# Altium schematic sheet AWG_ClockRecovery.SchDoc: Clock recovery
size 420 x 297 mm; EDA_Number: ARTIQ; Projet: ARTIQ/SINARA; CheckedBy: G.Kasprowicz; Author: F.Switakowski; CompanyName: WUT ISE; DrawnBy: F.Switakowski; Organization: WUT ISE; Address1: PW ISE; Address2: Nowowiejska 15/19 00-665 Warsaw; Address3: gkasprow@gmail.com; DocumentNumber: 4; Revision: 1; SheetNumber: 4; SheetTotal: 20; ModifiedBy: -; CheckedDate: -; Title2: & distribution; DivGrp: WUT ISE; Designer: G.Kasprowicz; ModifiedDate: -; ProjectName: Sensor Box
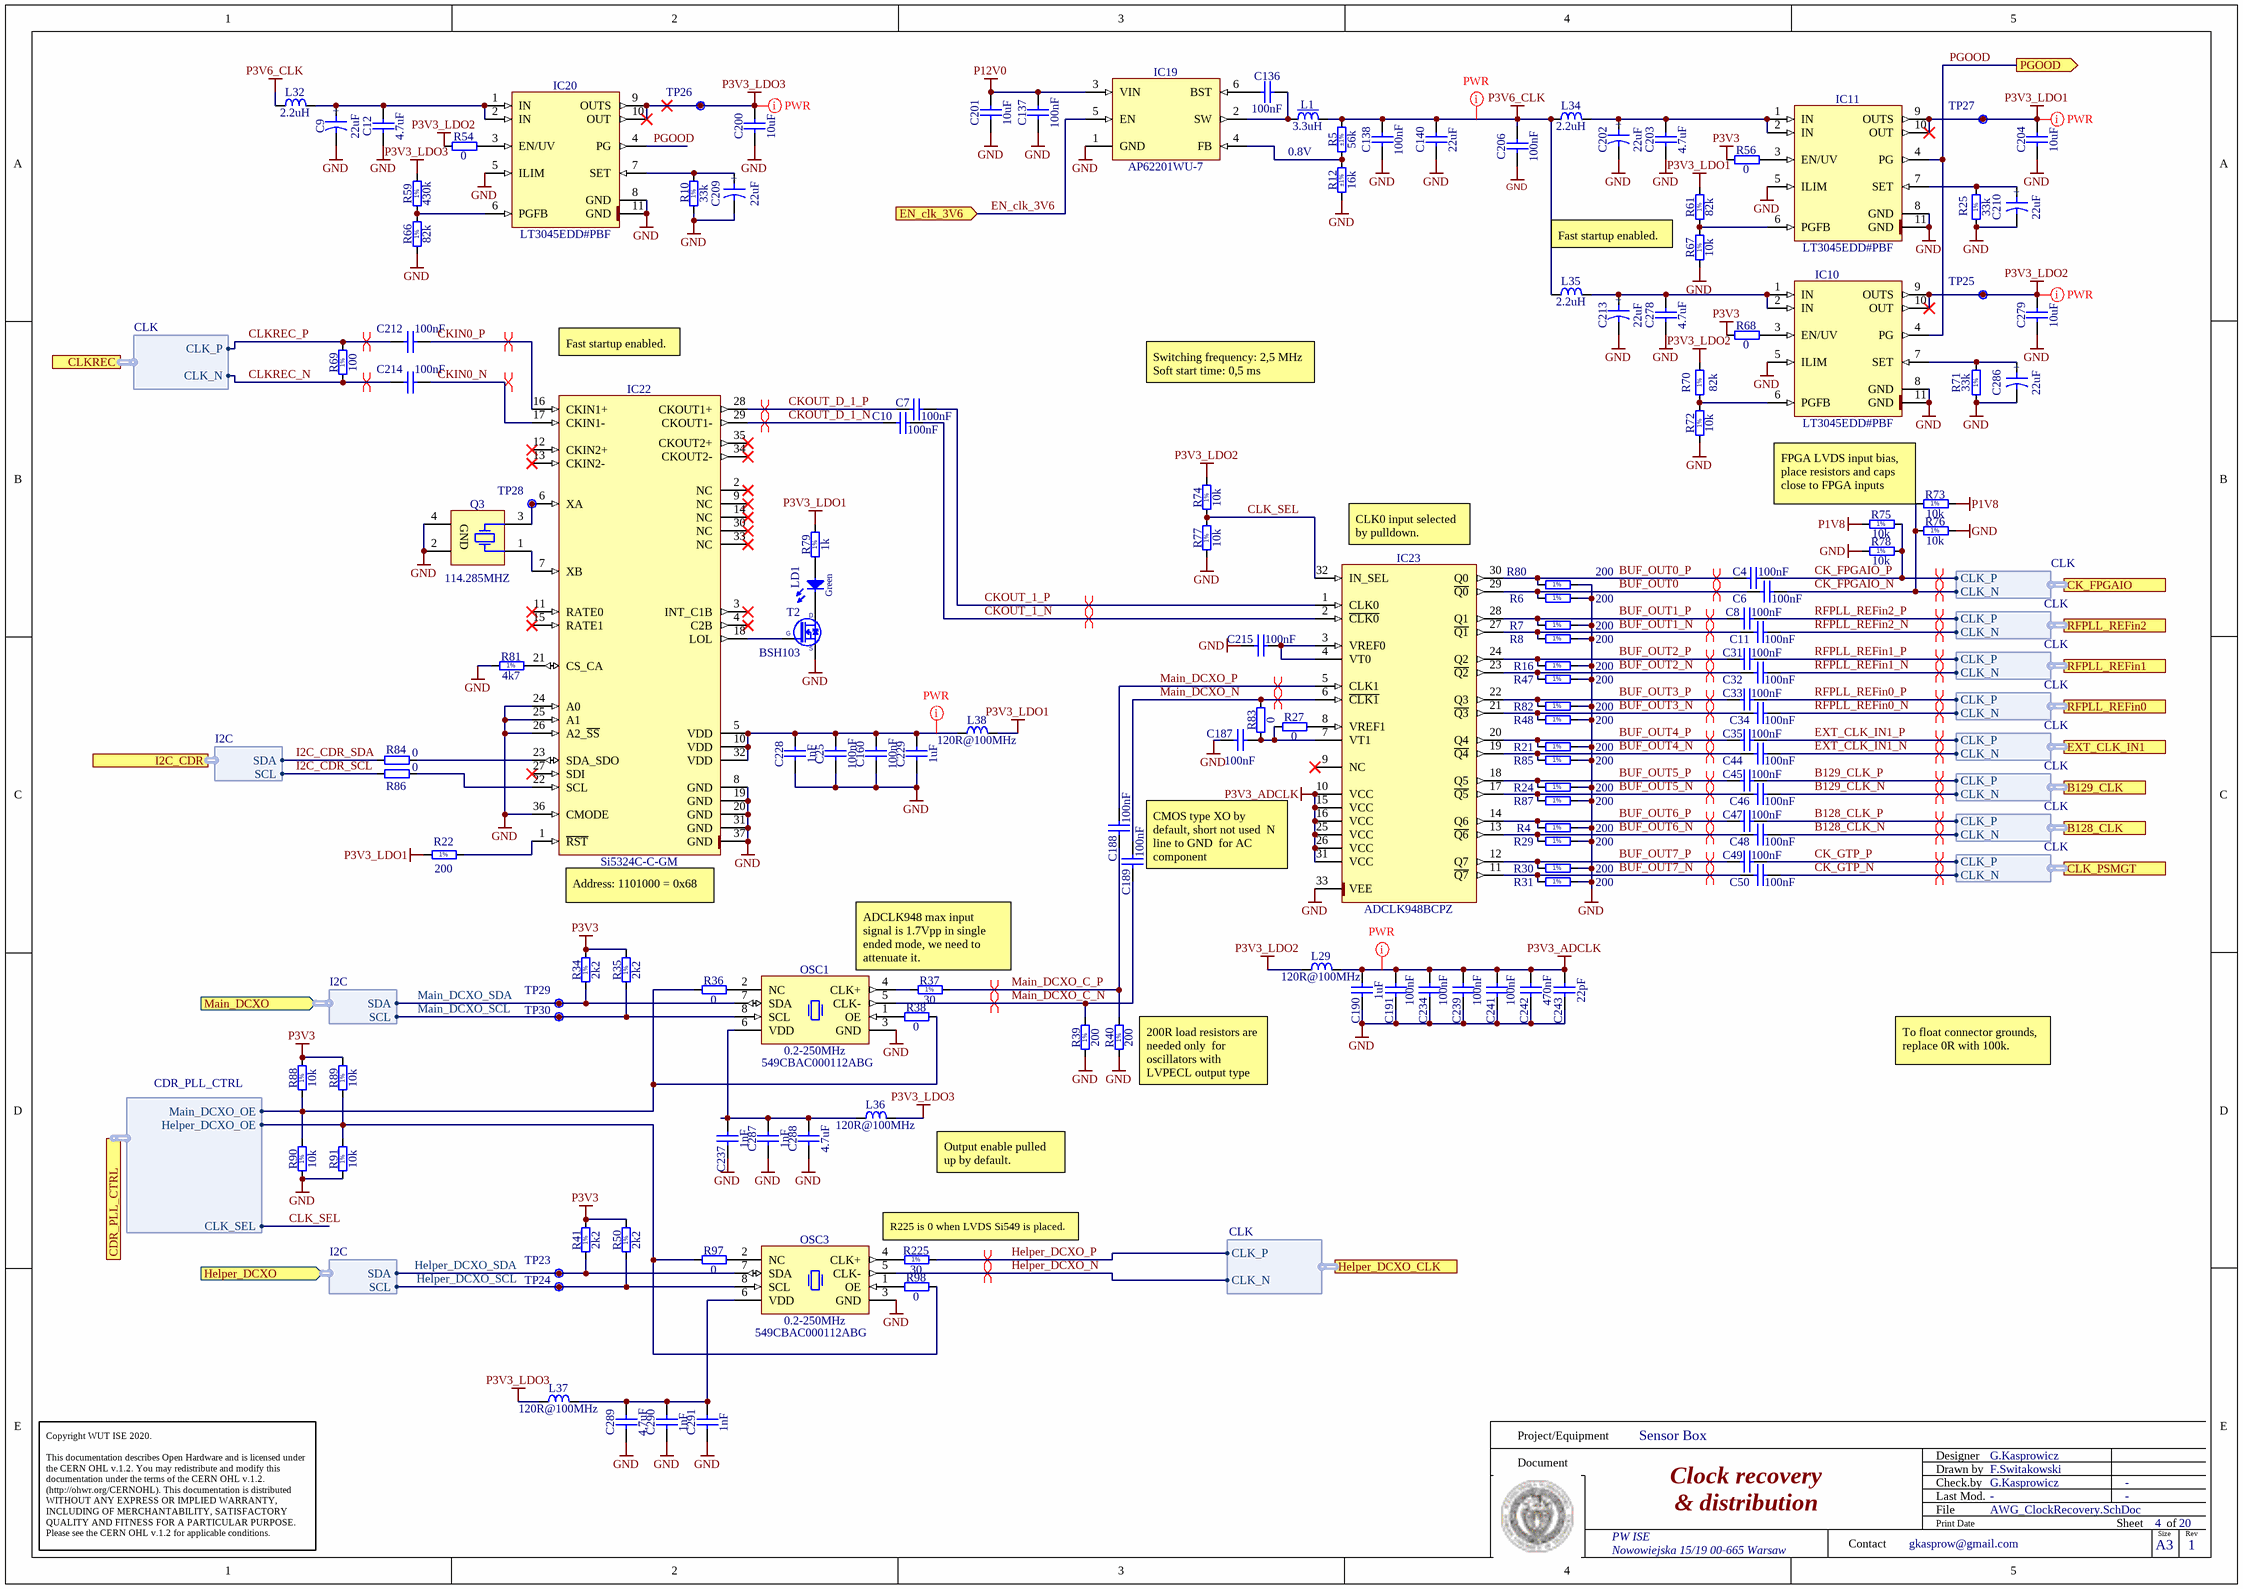
[diagram p0: AWG_ClockRecovery.SchDoc]

## Parts
C4  100nF  [CAPC0603X33N]
C6  100nF  [CAPC0603X33N]
C7  100nF  [CAPC0603X33N]
C8  100nF  [CAPC0603X33N]
C9  22uF  [CAPMP3216X180N]
C10  100nF  [CAPC0603X33N]
C11  100nF  [CAPC0603X33N]
C12  4.7uF  [CAPC1005X55N]
C25  100nF  [CAPC1005X55N]
C31  100nF  [CAPC0603X33N]
C32  100nF  [CAPC0603X33N]
C33  100nF  [CAPC0603X33N]
C34  100nF  [CAPC0603X33N]
C35  100nF  [CAPC0603X33N]
C44  100nF  [CAPC0603X33N]
C45  100nF  [CAPC0603X33N]
C46  100nF  [CAPC0603X33N]
C47  100nF  [CAPC0603X33N]
C48  100nF  [CAPC0603X33N]
C49  100nF  [CAPC0603X33N]
C50  100nF  [CAPC0603X33N]
C136  100nF  [CAPC1005X55N]
C137  100nF  [CAPC1005X55N]
C138  100nF  [CAPC1005X55N]
C140  22uF  [CAPC2012X135N]
C160  100nF  [CAPC1005X55N]
C187  100nF  [CAPC0603X33N]
C188  100nF  [CAPC0603X33N]
C189  100nF  [CAPC0603X33N]
C190  1uF  [CAPC1005X55N]
C191  100nF  [CAPC0603X33N]
C200  10uF  [CAPC1005X70N]
C201  10uF  [CAPC1608X80N]
C202  22uF  [CAPMP3216X180N]
C203  4.7uF  [CAPC1005X55N]
C204  10uF  [CAPC1005X70N]
C206  100nF  [CAPC1005X55N]
C209  22uF  [CAPMP3216X180N]
C210  22uF  [CAPMP3216X180N]
C212  100nF  [CAPC0603X33N]
C213  22uF  [CAPMP3216X180N]
C214  100nF  [CAPC0603X33N]
C215  100nF  [CAPC0603X33N]
C228  1nF  [CAPC1005X55N]
C229  1uF  [CAPC1005X55N]
C234  100nF  [CAPC0603X33N]
C237  1nF  [CAPC1005X55N]
C239  100nF  [CAPC0603X33N]
C241  100nF  [CAPC0603X33N]
C242  470nF  [CAPC0603X33N]
C243  22pF  [CAPC1005X55N]
C278  4.7uF  [CAPC1005X55N]
C279  10uF  [CAPC1005X70N]
C286  22uF  [CAPMP3216X180N]
C287  1nF  [CAPC1005X55N]
C288  4.7uF  [CAPC2012X135N]
C289  4.7uF  [CAPC2012X135N]
C290  1nF  [CAPC1005X55N]
C291  1nF  [CAPC1005X55N]
IC10  LT3045EDD#PBF  [SON50P300X300X80-11N-R175X248]
IC11  LT3045EDD#PBF  [SON50P300X300X80-11N-R175X248]
IC19  AP62201WU-7  [SOT95P280X100-6N]
IC20  LT3045EDD#PBF  [SON50P300X300X80-11N-R175X248]
IC22  Si5324C-C-GM  [QFN50P600X600X90-37N-S425]
IC23  ADCLK948BCPZ  [QFN50P500X500X80-33N-S285]
L1  3.3uH  [IND_WURTH_WE-TPC_4828]
L29  120R@100MHz  [INDC1608X65N]
L32  2.2uH  [IND_WURTH_WE-PMCI_0806LR]
L34  2.2uH  [IND_WURTH_WE-PMCI_0806LR]
L35  2.2uH  [IND_WURTH_WE-PMCI_0806LR]
L36  120R@100MHz  [INDC1608X65N]
L37  120R@100MHz  [INDC1608X65N]
L38  120R@100MHz  [INDC1608X65N]
LD1  Green  [LED_KINGBRIGHT_KPH-1608CGCK]
OSC1  0.2-250MHz  Manufacturer Part Number: 549CBAC000112ABG  [OSC_SILICON-LAB_SI549-A]
OSC3  0.2-250MHz  Manufacturer Part Number: 549CBAC000112ABG  [OSC_SILICON-LAB_SI549-A]
Q3  114.285MHZ  [XTAL_CONNOR_CS]
R4  200  [RESC1005X40N]
R5  56k  Tolerance: ±1%  [RESC1005X40N]
R6  200  [RESC1005X40N]
R7  200  [RESC1005X40N]
R8  200  [RESC1005X40N]
R10  33k  [RESC1005X40N]
R12  16k  Tolerance: ±1%  [RESC1005X40N]
R16  200  [RESC1005X40N]
R21  200  [RESC1005X40N]
R22  200  [RESC1005X40N]
R24  200  [RESC1005X40N]
R25  33k  [RESC1005X40N]
R27  0  [RESC1005X40N]
R29  200  [RESC1005X40N]
R30  200  [RESC1005X40N]
R31  200  [RESC1005X40N]
R34  2k2  [RESC1005X40N]
R35  2k2  [RESC1005X40N]
R36  0  [RESC1005X40N]
R37  30  [RESC1005X40N]
R38  0  [RESC1005X40N]
R39  200  [RESC1005X40N]
R40  200  [RESC1005X40N]
R41  2k2  [RESC1005X40N]
R47  200  [RESC1005X40N]
R48  200  [RESC1005X40N]
R50  2k2  [RESC1005X40N]
R54  0  [RESC1005X40N]
R56  0  [RESC1005X40N]
R59  430k  [RESC1005X40N]
R61  82k  [RESC1005X40N]
R66  82k  [RESC1005X40N]
R67  10k  [RESC1005X40N]
R68  0  [RESC1005X40N]
R69  100  [RESC1005X40N]
R70  82k  [RESC1005X40N]
R71  33k  [RESC1005X40N]
R72  10k  [RESC1005X40N]
R73  10k  [RESC1005X40N]
R74  10k  [RESC1005X40N]
R75  10k  [RESC1005X40N]
R76  10k  [RESC1005X40N]
R77  10k  [RESC1005X40N]
R78  10k  [RESC1005X40N]
R79  1k  [RESC1005X40N]
R80  200  [RESC1005X40N]
R81  4k7  [RESC1005X40N]
R82  200  [RESC1005X40N]
R83  0  [RESC1005X40N]
R84  0  [RESC1005X40N]
R85  200  [RESC1005X40N]
R86  0  [RESC1005X40N]
R87  200  [RESC1005X40N]
R88  10k  [RESC1005X40N]
R89  10k  [RESC1005X40N]
R90  10k  [RESC1005X40N]
R91  10k  [RESC1005X40N]
R97  0  [RESC1005X40N]
R98  0  [RESC1005X40N]
R225  30  [RESC1005X40N]
T2  BSH103  [SOT95P230X110-3N]
TP23  Test Point  [TPS127]  (value not drawn)  (no BOM)
TP24  Test Point  [TPS127]  (value not drawn)  (no BOM)
TP25  Test Point  [TPS127]  (value not drawn)  (no BOM)
TP26  Test Point  [TPS127]  (value not drawn)  (no BOM)
TP27  Test Point  [TPS127]  (value not drawn)  (no BOM)
TP28  Q1  [TPS127]  (value not drawn)  (no BOM)
TP29  Test Point  [TPS127]  (value not drawn)  (no BOM)
TP30  Test Point  [TPS127]  (value not drawn)  (no BOM)

## Ports
B128_CLK (harness CLK), B129_CLK (harness CLK), CDR_PLL_CTRL (harness CDR_PLL_CTRL), CK_FPGAIO (harness CLK), CLK_PSMGT (harness CLK), CLKREC (harness CLK), EN_clk_3V6 (in), EXT_CLK_IN1 (harness CLK), Helper_DCXO (in, harness I2C), Helper_DCXO_CLK (harness CLK), I2C_CDR (harness I2C), Main_DCXO (in, harness I2C), PGOOD (out), RFPLL_REFin0 (harness CLK), RFPLL_REFin1 (harness CLK), RFPLL_REFin2 (harness CLK)

## Harnesses
CDR_PLL_CTRL: Main_DCXO_OE, Helper_DCXO_OE, CLK_SEL
CLK: CLK_P, CLK_N
I2C: SDA, SCL

## Nets
GND: C9.2 C12.1 C25.1 C137.1 C138.1 C140.1 C160.1 C187.1 C190.1 C191.1 C200.1 C201.1 C202.2 C203.1 C204.1 C206.1 C209.2 C210.2 C213.2 C215.1 C228.1 C229.1 C234.1 C237.1 C239.1 C241.1 C242.1 C243.1 C278.1 C279.1 C286.2 C287.1 C288.1 C289.1 C290.1 C291.1 IC10.5(ILIM) IC10.8(GND) IC10.11(GND) IC11.5(ILIM) IC11.8(GND) IC11.11(GND) IC19.1(GND) IC20.5(ILIM) IC20.8(GND) IC20.11(GND) IC22.8(GND) IC22.19(GND) IC22.20(GND) IC22.24(A0) IC22.25(A1) IC22.26(A2_~{SS}) IC22.31(GND) IC22.36(CMODE) IC22.37(GND) IC23.33(VEE) OSC1.3(GND) OSC3.3(GND) Q3.2(GND) Q3.4(GND) R4.2 R6.2 R7.2 R8.2 R10.1 R12.1 R16.2 R21.2 R24.2 R25.1 R29.2 R30.2 R31.2 R39.1 R40.1 R47.2 R48.2 R66.1 R67.2 R71.1 R72.2 R76.1 R77.1 R78.1 R80.2 R81.1 R82.2 R85.2 R87.2 R90.1 R91.1 T2.2(S)
P1V8: R73.1 R75.1
P3V3: R34.2 R35.2 R41.2 R50.2 R56.1 R68.1 R88.2 R89.2
P3V3_ADCLK: C190.2 C191.2 C234.2 C239.2 C241.2 C242.2 C243.2 IC23.10(VCC) IC23.15(VCC) IC23.16(VCC) IC23.25(VCC) IC23.26(VCC) IC23.31(VCC) L29.1
P3V3_LDO1: C204.2 IC11.9(OUTS) IC11.10(OUT) L38.2 R22.1 R61.2 R79.2 TP27.1
P3V3_LDO2: C279.2 IC10.9(OUTS) IC10.10(OUT) L29.2 R54.1 R70.2 R74.2 TP25.1
P3V3_LDO3: C200.2 IC20.9(OUTS) IC20.10(OUT) L36.1 L37.1 R59.2 TP26.1
P3V6_CLK: C138.2 C140.2 C206.2 L1.2 L32.1 L34.1 L35.1 R5.2
P12V0: C137.2 C201.2 IC19.3(VIN)
B128_CLK_N: C48.2 ; port B128_CLK.CLK_N
B128_CLK_P: C47.2 ; port B128_CLK.CLK_P
B129_CLK_N: C46.2 ; port B129_CLK.CLK_N
B129_CLK_P: C45.2 ; port B129_CLK.CLK_P
BUF_OUT0: C6.1 IC23.29(~{Q0}) R6.1
BUF_OUT0_P: C4.1 IC23.30(Q0) R80.1
BUF_OUT1_N: C11.1 IC23.27(~{Q1}) R8.1
BUF_OUT1_P: C8.1 IC23.28(Q1) R7.1
BUF_OUT2_N: C32.1 IC23.23(~{Q2}) R47.1
BUF_OUT2_P: C31.1 IC23.24(Q2) R16.1
BUF_OUT3_N: C34.1 IC23.21(~{Q3}) R48.1
BUF_OUT3_P: C33.1 IC23.22(Q3) R82.1
BUF_OUT4_N: C44.1 IC23.19(~{Q4}) R85.1
BUF_OUT4_P: C35.1 IC23.20(Q4) R21.1
BUF_OUT5_N: C46.1 IC23.17(~{Q5}) R87.1
BUF_OUT5_P: C45.1 IC23.18(Q5) R24.1
BUF_OUT6_N: C48.1 IC23.13(~{Q6}) R29.1
BUF_OUT6_P: C47.1 IC23.14(Q6) R4.1
BUF_OUT7_N: C50.1 IC23.11(~{Q7}) R31.1
BUF_OUT7_P: C49.1 IC23.12(Q7) R30.1
CK_FPGAIO_N: C6.2 R73.2 R76.2 ; port CK_FPGAIO.CLK_N
CK_FPGAIO_P: C4.2 R75.2 R78.2 ; port CK_FPGAIO.CLK_P
CK_GTP_N: C50.2 ; port CLK_PSMGT.CLK_N
CK_GTP_P: C49.2 ; port CLK_PSMGT.CLK_P
CKIN0_N: C214.2 IC22.17(CKIN1-)
CKIN0_P: C212.2 IC22.16(CKIN1+)
CKOUT_1_N: C10.2 IC23.2(~{CLK0})
CKOUT_1_P: C7.2 IC23.1(CLK0)
CKOUT_D_1_N: C10.1 IC22.29(CKOUT1-)
CKOUT_D_1_P: C7.1 IC22.28(CKOUT1+)
CLK_SEL: IC23.32(IN_SEL) R74.1 R77.2 ; port CDR_PLL_CTRL.CLK_SEL
CLKREC_N: C214.1 R69.1 ; port CLKREC.CLK_N
CLKREC_P: C212.1 R69.2 ; port CLKREC.CLK_P
EN_clk_3V6: IC19.5(EN) ; port EN_clk_3V6
EXT_CLK_IN1_N: C44.2 ; port EXT_CLK_IN1.CLK_N
EXT_CLK_IN1_P: C35.2 ; port EXT_CLK_IN1.CLK_P
Helper_DCXO_N: OSC3.5(CLK-) ; port Helper_DCXO_CLK.CLK_N
Helper_DCXO_P: R225.2 ; port Helper_DCXO_CLK.CLK_P
Helper_DCXO_SCL: OSC3.8(SCL) R50.1 TP24.1 ; port Helper_DCXO.SCL
Helper_DCXO_SDA: OSC3.7(SDA) R41.1 TP23.1 ; port Helper_DCXO.SDA
I2C_CDR_SCL: R86.1 ; port I2C_CDR.SCL
I2C_CDR_SDA: R84.1 ; port I2C_CDR.SDA
Main_DCXO_C_N: C189.1 OSC1.5(CLK-) R39.2
Main_DCXO_C_P: C188.1 R37.2 R40.2
Main_DCXO_N: C189.2 IC23.6(~{CLK1}) R83.2
Main_DCXO_P: C188.2 IC23.5(CLK1)
Main_DCXO_SCL: OSC1.8(SCL) R35.1 TP30.1 ; port Main_DCXO.SCL
Main_DCXO_SDA: OSC1.7(SDA) R34.1 TP29.1 ; port Main_DCXO.SDA
PGOOD: IC10.4(PG) IC11.4(PG) IC20.4(PG) ; port PGOOD
RFPLL_REFin0_N: C34.2 ; port RFPLL_REFin0.CLK_N
RFPLL_REFin0_P: C33.2 ; port RFPLL_REFin0.CLK_P
RFPLL_REFin1_N: C32.2 ; port RFPLL_REFin1.CLK_N
RFPLL_REFin1_P: C31.2 ; port RFPLL_REFin1.CLK_P
RFPLL_REFin2_N: C11.2 ; port RFPLL_REFin2.CLK_N
RFPLL_REFin2_P: C8.2 ; port RFPLL_REFin2.CLK_P
NetC9_1: C9.1 C12.2 IC20.1(IN) IC20.2(IN) L32.2
NetC25_2: C25.2 C160.2 C228.2 C229.2 IC22.5(VDD) IC22.10(VDD) IC22.32(VDD) L38.1
NetC136_1: C136.1 IC19.6(BST)
NetC136_2: C136.2 IC19.2(SW) L1.1
NetC187_2: C187.2 IC23.7(VT1) R27.1 R83.1
NetC202_1: C202.1 C203.2 IC11.1(IN) IC11.2(IN) L34.2
NetC209_1: C209.1 IC20.7(SET) R10.2
NetC210_1: C210.1 IC11.7(SET) R25.2
NetC213_1: C213.1 C278.2 IC10.1(IN) IC10.2(IN) L35.2
NetC215_2: C215.2 IC23.3(VREF0) IC23.4(VT0)
NetC237_2: C237.2 C287.2 C288.2 L36.2 OSC1.6(VDD)
NetC286_1: C286.1 IC10.7(SET) R71.2
NetC289_2: C289.2 C290.2 C291.2 L37.2 OSC3.6(VDD)
NetIC10_3: IC10.3(EN/UV) R68.2
NetIC10_6: IC10.6(PGFB) R70.1 R72.1
NetIC11_3: IC11.3(EN/UV) R56.2
NetIC11_6: IC11.6(PGFB) R61.1 R67.1
NetIC19_4: IC19.4(FB) R5.1 R12.2
NetIC20_3: IC20.3(EN/UV) R54.2
NetIC20_6: IC20.6(PGFB) R59.1 R66.2
NetIC22_1: IC22.1(~{RST}) R22.2
NetIC22_6: IC22.6(XA) Q3.3(X) TP28.1
NetIC22_7: IC22.7(XB) Q3.1(X)
NetIC22_18: IC22.18(LOL) T2.1(G)
NetIC22_21: IC22.21(CS_CA) R81.2
NetIC22_22: IC22.22(SCL) R86.2
NetIC22_23: IC22.23(SDA_SDO) R84.2
NetIC23_8: IC23.8(VREF1) R27.2
NetLD1_1: LD1.1(C) T2.3(D)
NetLD1_2: LD1.2(A) R79.1
NetOSC1_1: OSC1.1(OE) R38.1
NetOSC1_2: OSC1.2(NC) R36.2
NetOSC1_4: OSC1.4(CLK+) R37.1
NetOSC3_1: OSC3.1(OE) R98.1
NetOSC3_2: OSC3.2(NC) R97.2
NetOSC3_4: OSC3.4(CLK+) R225.1
NetR36_1: R36.1 R38.2 R88.1 R90.2 ; port CDR_PLL_CTRL.Main_DCXO_OE
NetR89_1: R89.1 R91.2 R97.1 R98.2 ; port CDR_PLL_CTRL.Helper_DCXO_OE

Not connected (* = marked no-connect by the designer): IC22 2(NC)* 3(INT_C1B)* 4(C2B)* 9(NC)* 11(RATE0)* 12(CKIN2+)* 13(CKIN2-)* 14(NC)* 15(RATE1)* 27(SDI)* 30(NC)* 33(NC)* 34(CKOUT2-)* 35(CKOUT2+)*; IC23 9(NC)*

## Layout directives
differential pair; differential pair class LVPECL: B128_CLK_N, B128_CLK_P, B129_CLK_N, B129_CLK_P, BUF_OUT0, BUF_OUT0_P, BUF_OUT1_N, BUF_OUT1_P, BUF_OUT2_N, BUF_OUT2_P, BUF_OUT3_N, BUF_OUT3_P, BUF_OUT4_N, BUF_OUT4_P, BUF_OUT5_N, BUF_OUT5_P, BUF_OUT6_N, BUF_OUT6_P, BUF_OUT7_N, BUF_OUT7_P, CK_FPGAIO_N, CK_FPGAIO_P, CK_GTP_N, CK_GTP_P, CKOUT_1_N, CKOUT_1_P, CKOUT_D_1_N, CKOUT_D_1_P, EXT_CLK_IN1_N, EXT_CLK_IN1_P, RFPLL_REFin0_N, RFPLL_REFin0_P, RFPLL_REFin1_N, RFPLL_REFin1_P, RFPLL_REFin2_N, RFPLL_REFin2_P
differential pair; differential pair class Diff_100Ohm: CKIN0_N, CKIN0_P, CLKREC_N, CLKREC_P, Helper_DCXO_N, Helper_DCXO_P, Main_DCXO_C_N, Main_DCXO_C_P, Main_DCXO_N, Main_DCXO_P
net class PWR: NetC25_2, P3V3_ADCLK, P3V3_LDO1, P3V3_LDO2, P3V3_LDO3, P3V6_CLK

## Notes on the sheet
- 0.8V
- Fast startup enabled.
- Switching frequency: 2,5 MHz
  Soft start time: 0,5 ms
- (near R73) FPGA LVDS input bias, place resistors and caps close to FPGA inputs
- (near IC23) CLK0 input selected by pulldown.
- (near C189) CMOS type XO by  default, short not used  N line to GND  for AC component
- (near IC22) Address: 1101000 = 0x68
- ADCLK948 max input signal is 1.7Vpp in single  ended mode, we need to attenuate it.
- To float connector grounds, replace 0R with 100k.
- (near R40) 200R load resistors are needed only  for oscillators with  LVPECL output type
- (near L36) Output enable pulled up by default.
- R225 is 0 when LVDS Si549 is placed.
- Project/Equipment
- Document
- Designer
- Drawn by
- Check.by
- Copyright WUT ISE 2020.
  This documentation describes Open Hardware and is licensed under the CERN OHL v.1.2. You may redistribute and modify this documentation under the terms of the CERN OHL v.1.2. (http://ohwr.org/CERNOHL). This documentation is distributed WITHOUT ANY EXPRESS OR IMPLIED WARRANTY, INCLUDING OF MERCHANTABILITY, SATISFACTORY QUALITY AND FITNESS FOR A PARTICULAR PURPOSE. Please see the CERN OHL v.1.2 for applicable conditions.
- Contact
- File
- Last Mod.
- Print Date
- Sheet
- Size
- A3
- of
- Rev
- (in symbol CTE3216-18_22UF_6.3V_10%_LESR0900) +
- (in symbol R0402_1k_1%_0.0625W_100PPM) 1%
- (in symbol R0402_2K2_1%_0.0625W_100PPM) 1%
- (in symbol R0402_4K7_1%_0.0625W_100PPM) 1%
- (in symbol R0402_10K_1%_0.0625W_100PPM) 1%
- (in symbol R0402_30R_1%_0.0625W_100PPM) 1%
- (in symbol R0402_33K_1%_0.0625W_100PPM) 1%
- (in symbol R0402_82K_1%_0.0625W_100PPM) 1%
- (in symbol R0402_100R_1%_0.0625W_100PPM) 1%
- (in symbol R0402_200R_1%_0.0625W_100PPM) 1%
- (in symbol R0402_430K_1%_0.0625W_100PPM) 1%

## Library data of the parts
C4 C6-C8 C10 C11 C31-C35 C44-C50 C187-C189 C191 C212 C214 C215 C234 C239 C241 = CC0201_100NF_6.3V_10%_X5R: Non-polarised capacitor; Part Description: SMD Multilayer Chip Ceramic Capacitor; Manufacturer: GENERIC; Manufacturer1 Part Number: 02016D104KAT2A; Voltage: 6.3V; TC: X5R; Tolerance: ±10%; Part Number: CC0201_100NF_6.3V_10%_X5R; Component Kind: Standard; Component Type: Standard; Pin Count: 2; Value: 100nF; Status: Not Recommended; Manufacturer Part Number: CC0201_100NF_6.3V_10%_X5R; Case: 0201; Mounted: Yes; Socket: No; SMD: Yes; Sense: No; Manufacturer1 Example: AVX; Manufacturer1 ComponentHeight: 0.33mm; HelpURL: \\cern.ch\dfs\Applications\Altium\Datasheets\CC0201_X5R_AVX.pdf; Author: CERN DEM JLC; CreateDate: 2007-12-03; LatestRevisionDate: 2007-12-03
C9 C202 C209 C210 C213 C286 = CTE3216-18_22UF_6.3V_10%_LESR0900: Polarised capacitor; Part Description: Low ESR 0R9 Solid Tantalum Chip Capacitor; Manufacturer: GENERIC; Manufacturer1 Part Number: TPSA226K006R0900; Voltage: 6.3V; Tolerance: ±10%; Part Number: CTE3216-18_22UF_6.3V_10%_LESR0900; Component Kind: Standard; Component Type: Standard; Pin Count: 2; Value: 22uF; Status: Preferred; Manufacturer Part Number: CTE3216-18_22UF_6.3V_10%_LESR0900; Case: A; Mounted: Yes; Socket: No; SMD: Yes; Sense: No; Manufacturer1 Example: AVX; Manufacturer1 ComponentHeight: 1.8mm; HelpURL: \\cern.ch\dfs\Applications\Altium\Datasheets\CTE-LESR_AVX_TPS.pdf; Author: CERN DEM JLC; CreateDate: 05.05.2008; LatestRevisionDate: 20.01.2009
C12 C203 C278 = CC0402_4.7UF_6.3V_20%_X5R: Non-polarised capacitor; Part Description: SMD Multilayer Chip Ceramic Capacitor; Manufacturer: GENERIC; Manufacturer1 Part Number: C1005X5R0J475M050BC; Voltage: 6.3V; TC: X5R; Tolerance: ±20%; Part Number: CC0402_4.7UF_6.3V_20%_X5R; Component Kind: Standard; Component Type: Standard; Pin Count: 2; Value: 4.7uF; Status: Preferred; Manufacturer Part Number: CC0402_4.7UF_6.3V_20%_X5R; Case: 0402; Mounted: Yes; Socket: No; SMD: Yes; Sense: No; Manufacturer1 Example: TDK; Manufacturer1 ComponentHeight: 0.65mm; HelpURL: \\cern.ch\dfs\Applications\Altium\Datasheets\CC0402_X5R_TDK_C.pdf; Author: CERN DEM JLC; CreateDate: 03.03.2015; LatestRevisionDate: 03.03.2015
C25 C136 C137 C160 C206 = CC0402_100NF_16V_10%_X7R: Non-polarised capacitor; Part Description: SMD Multilayer Chip Ceramic Capacitor; Manufacturer: GENERIC; Manufacturer1 Part Number: GRM155R71C104KA88D; Voltage: 16V; TC: X7R; Tolerance: ±10%; Part Number: CC0402_100NF_16V_10%_X7R; Component Kind: Standard; Component Type: Standard; Pin Count: 2; Value: 100nF; Status: Not Recommended; Manufacturer Part Number: CC0402_100NF_16V_10%_X7R; Case: 0402; Mounted: Yes; Socket: No; SMD: Yes; Sense: No; Manufacturer1 Example: MURATA; Manufacturer1 ComponentHeight: 0.55mm; HelpURL: \\cern.ch\dfs\Applications\Altium\Datasheets\CC0402_X7R_MURATA_GRM.pdf; Author: CERN DEM JLC
  C25 C136 C137 C160: CreateDate: 05.12.2013; LatestRevisionDate: 03.12.2007
  C206: CreateDate: 05/12/2013; LatestRevisionDate: 03/12/2007
C138 = CC0402_100NF_16V_10%_X5R: Non-polarised capacitor; Part Description: SMD Multilayer Chip Ceramic Capacitor; Manufacturer: GENERIC; Manufacturer1 Part Number: GRM155R61C104KA88D; Voltage: 16V; TC: X5R; Tolerance: ±10%; Part Number: CC0402_100NF_16V_10%_X5R; Component Kind: Standard; Component Type: Standard; Pin Count: 2; Value: 100nF; Status: None; Manufacturer Part Number: CC0402_100NF_16V_10%_X5R; Case: 0402; Mounted: Yes; Socket: No; SMD: Yes; Sense: No; Manufacturer1 Example: MURATA; Manufacturer1 ComponentHeight: 0.55mm; HelpURL: \\cern.ch\dfs\Applications\Altium\Datasheets\CC0402_X5R_MURATA_GRM.pdf; Author: CERN DEM JLC; CreateDate: 10.12.2013; LatestRevisionDate: 10.12.2013
C140 = CC0805_22UF_16V_10%_X5R: Non-polarised capacitor; Part Description: SMD Multilayer Chip Ceramic Capacitor; Manufacturer: GENERIC; Manufacturer1 Part Number: C2012X5R1C226KT; Voltage: 16V; TC: X5R; Tolerance: ±10%; Part Number: CC0805_22UF_16V_10%_X5R; Component Kind: Standard; Component Type: Standard; Pin Count: 2; Value: 22uF; Status: Preferred; Manufacturer Part Number: CC0805_22UF_16V_10%_X5R; Case: 0805; Mounted: Yes; Socket: No; SMD: Yes; Sense: No; Manufacturer1 Example: TDK; Manufacturer1 ComponentHeight: 1.35mm; HelpURL: \\cern.ch\dfs\Applications\Altium\Datasheets\CC0805_X5R_TDK_C.pdf; Author: CERN DEM JLC; CreateDate: 25.10.2012; LatestRevisionDate: 25.10.2012
C190 C229 = CC0402_1UF_16V_10%_X5R: Non-polarised capacitor; Part Description: SMD Multilayer Chip Ceramic Capacitor; Manufacturer: GENERIC; Manufacturer1 Part Number: C1005X5R1C105KT; Voltage: 16V; TC: X5R; Tolerance: ±10%; Part Number: CC0402_1UF_16V_10%_X5R; Component Kind: Standard; Component Type: Standard; Pin Count: 2; Value: 1uF; Status: Preferred; Manufacturer Part Number: CC0402_1UF_16V_10%_X5R; Case: 0402; Mounted: Yes; Socket: No; SMD: Yes; Sense: No; Manufacturer1 Example: TDK; Manufacturer1 ComponentHeight: 0.55mm; HelpURL: \\cern.ch\dfs\Applications\Altium\Datasheets\CC0402_X5R_TDK_C.pdf; Author: CERN DEM JLC; CreateDate: 2012-10-25; LatestRevisionDate: 2012-10-25
C200 C204 C279 = CC0402_10UF_6.3V_20%_X5R: Non-polarised capacitor; Part Description: SMD Multilayer Chip Ceramic Capacitor; Manufacturer: GENERIC; Manufacturer1 Part Number: C1005X5R0J106M050BC; Voltage: 6.3V; TC: X5R; Tolerance: ±10%; Part Number: CC0402_10UF_6.3V_20%_X5R; Component Kind: Standard; Component Type: Standard; Pin Count: 2; Value: 10uF; Status: Preferred; Manufacturer Part Number: CC0402_10UF_6.3V_20%_X5R; Case: 0402; Mounted: Yes; Socket: No; SMD: Yes; Sense: No; Manufacturer1 Example: TDK; Manufacturer1 ComponentHeight: 0.70mm; HelpURL: \\cern.ch\dfs\Applications\Altium\Datasheets\CC0402_X5R_TDK_C.pdf; Author: CERN DEM JLC; CreateDate: 07.01.2015; LatestRevisionDate: 07.01.2015
C201 = CC0603_10UF_16V_20%_X5R: Non-polarised capacitor; Part Description: SMD Multilayer Chip Ceramic Capacitor; Manufacturer: GENERIC; Manufacturer1 Part Number: GRM188R61C106MA73D; Voltage: 16V; TC: X5R; Tolerance: ±20%; Part Number: CC0603_10UF_16V_20%_X5R; Component Kind: Standard; Component Type: Standard; Pin Count: 2; Value: 10uF; Status: None; Manufacturer Part Number: CC0603_10UF_16V_20%_X5R; Case: 0603; Mounted: Yes; Socket: No; SMD: Yes; Sense: No; Manufacturer1 Example: MURATA; Manufacturer1 ComponentHeight: 0.8mm; HelpURL: \\cern.ch\dfs\Applications\Altium\Datasheets\CC0603_X5R_MURATA_GRM.pdf; Author: CERN DEM MR; CreateDate: 02.03.2016; LatestRevisionDate: 02.03.2016
C228 C237 C287 C290 C291 = CC0402_1NF_50V_10%_X7R: Non-polarised capacitor; Part Description: SMD Multilayer Chip Ceramic Capacitor; Manufacturer: GENERIC; Manufacturer1 Part Number: 223858715623; Voltage: 50V; TC: X7R; Tolerance: ±10%; Part Number: CC0402_1NF_50V_10%_X7R; Component Kind: Standard; Component Type: Standard; Pin Count: 2; Value: 1nF; Status: Not Recommended; Manufacturer Part Number: CC0402_1NF_50V_10%_X7R; Case: 0402; Mounted: Yes; Socket: No; SMD: Yes; Sense: No; Manufacturer1 Example: PHYCOMP; Manufacturer1 ComponentHeight: 0.55mm; HelpURL: \\cern.ch\dfs\Applications\Altium\Datasheets\CC0402_X7R_PHYCOMP.pdf; Author: CERN DEM JLC; CreateDate: 03.12.2007; LatestRevisionDate: 03.12.2007
C242 = CC0201_470NF_4V_20%_X5R: Non-polarised capacitor; Part Description: SMD Multilayer Chip Ceramic Capacitor; Manufacturer: GENERIC; Manufacturer1 Part Number: AMK063BJ474MP-F; Voltage: 4V; TC: X5R; Tolerance: ±20%; Part Number: CC0201_470NF_4V_20%_X5R; Component Kind: Standard; Component Type: Standard; Pin Count: 2; Value: 470nF; Status: Not Recommended; Manufacturer Part Number: CC0201_470NF_4V_20%_X5R; Case: 0201; Mounted: Yes; Socket: No; SMD: Yes; Sense: No; Manufacturer1 Example: TAIYO YUDEN; Manufacturer1 ComponentHeight: 0.33mm; HelpURL: \\cern.ch\dfs\Applications\Altium\Datasheets\CC0201_X5R_TAIYO-YUDEN_STANDARD-CLASS2.pdf; Author: CERN DEM JLC; CreateDate: 27.05.2010; LatestRevisionDate: 27.05.2010
C243 = CC0402_22PF_50V_5%_C0G: Non-polarised capacitor; Part Description: SMD Multilayer Chip Ceramic Capacitor; Manufacturer: GENERIC; Manufacturer1 Part Number: C0402C220J5GACTU; Voltage: 50V; TC: C0G/NP0; Tolerance: ±5%; Part Number: CC0402_22PF_50V_5%_C0G; Component Kind: Standard; Component Type: Standard; Pin Count: 2; Value: 22pF; Status: Preferred; Manufacturer Part Number: CC0402_22PF_50V_5%_C0G; Case: 0402; Mounted: Yes; Socket: No; SMD: Yes; Sense: No; Manufacturer1 Example: KEMET; Manufacturer1 ComponentHeight: 0.55mm; HelpURL: \\cern.ch\dfs\Applications\Altium\Datasheets\CC0805_C0G_KEMET_(Commercial Grade).pdf; Author: CERN DEM JLC; CreateDate: 2007-12-03; LatestRevisionDate: 2007-12-03
C288 C289 = CC0805_4.7UF_10V_10%_X5R: Non-polarised capacitor; Part Description: SMD Multilayer Chip Ceramic Capacitor; Manufacturer: GENERIC; Manufacturer1 Part Number: 222224013672; Voltage: 10V; TC: X5R; Tolerance: ±10%; Part Number: CC0805_4.7UF_10V_10%_X5R; Component Kind: Standard; Component Type: Standard; Pin Count: 2; Value: 4.7uF; Status: Preferred; Manufacturer Part Number: CC0805_4.7UF_10V_10%_X5R; Case: 0805; Mounted: Yes; Socket: No; SMD: Yes; Sense: No; Manufacturer1 Example: PHYCOMP; Manufacturer1 ComponentHeight: 1.45mm; HelpURL: \\cern.ch\dfs\Applications\Altium\Datasheets\CC0805_X5R_PHYCOMP_HC.pdf; Author: CERN DEM JLC; CreateDate: 03.12.2007; LatestRevisionDate: 03.12.2007
IC10 IC11 IC20 = LT3045EDD#PBF: 20V, 500mA, Ultralow Noise, Ultrahigh PSRR Linear Regulator; Manufacturer: LINEAR TECHNOLOGY; PressFit: No; Bonding: No; Part Number: LT3045EDD#PBF; Component Kind: Standard; Component Type: Standard; Device: LT3045EDD#PBF; PackageDescription: SON, 0.50mm Pitch, 10-pin, 3.00mm W  X 3.00mm L X 0.80mm Height, (w/thermal tab 1.75 X 2.48 mm), IPC Medium Density; Part Description: 20V, 500mA, Ultralow Noise, Ultrahigh PSRR Linear Regulator; Manufacturer Part Number: LT3045EDD#PBF; Pin Count: 11; Case: SON10; Mounted: Yes; Socket: No; SMD: Yes; Sense: No; ComponentHeight: 0.8mm; HelpURL: \\cern.ch\dfs\Applications\Altium\Datasheets\LT3045EDD#PBF.pdf; Author: CERN DEM JLC; CreateDate: 07.12.2016; LatestRevisionDate: 07.12.2016
IC19 = AP62201WU-7: 4.2V TO 18V INPUT, 2A LOW IQ SYNCHRONOUS BUCK CONVERTER; Manufacturer: DIODES INCORPORATED; PressFit: No; Bonding: No; Part Number: AP62201WU-7; Component Kind: Standard; Component Type: Standard; Device: AP62201WU-7; PackageDescription: SOT23, 0.95mm Pitch; 6 Pin, 1.625mm W X 2.90mm L X 1.00mm H body, IPC Medium Density; Part Description: 4.2V TO 18V INPUT, 2A LOW IQ SYNCHRONOUS BUCK CONVERTER; Manufacturer Part Number: AP62201WU-7; Pin Count: 6; Case: SOT23-6; Mounted: Yes; Socket: No; SMD: Yes; Sense: No; ComponentHeight: 1.1mm; HelpURL: \\cern.ch\dfs\Applications\Altium\Datasheets\AP6220x.pdf; Author: CERN DEM HF; CreateDate: 07.01.2022; LatestRevisionDate: 07.01.2022
IC22 = Si5324C-C-GM: Any Frequency Precision Clock Multiplier/Jitter Attenuator; Manufacturer: SILICON LABS; PressFit: No; Bonding: No; Part Number: Si5324C-C-GM; Component Kind: Standard; Component Type: Standard; Device: Si5324C-C-GM; PackageDescription: QFN, 0.50mm Pitch, Square; 36 Pin, 6.00mm L X 6.00mm W X 0.90mm H Body (w/thermal tab 4.25m x 4.25mm), IPC Medium Density; Part Description: Any Frequency Precision Clock Multiplier/Jitter Attenuator; Manufacturer Part Number: Si5324C-C-GM; Pin Count: 37; Case: QFN36; Mounted: Yes; Socket: No; SMD: Yes; Sense: No; ComponentHeight: 0.9mm; HelpURL: \\cern.ch\dfs\Applications\Altium\Datasheets\Si5324C-C-GM.pdf; Author: CERN DEM JLC; CreateDate: 19.08.2013; LatestRevisionDate: 19.08.2013
IC23 = ADCLK948BCPZ: Two Selectable Inputs, 8 LVPECL Outputs, SiGe Clock Fanout Buffer; Manufacturer: ANALOG DEVICES; PressFit: No; Bonding: No; Part Number: ADCLK948BCPZ; Component Kind: Standard; Component Type: Standard; Device: ADCLK948BCPZ; PackageDescription: QFN, 0.50mm Pitch, Square; 8 Pin X 8 Pin, 5mm X 5mm X 1.00mm H body (w/thermal tab 2.85 X 2.85mm),  IPC Medium Density; Part Description: Two Selectable Inputs, 8 LVPECL Outputs, SiGe Clock Fanout Buffer; Manufacturer Part Number: ADCLK948BCPZ; Pin Count: 33; Case: QFN32; Mounted: Yes; Socket: No; SMD: Yes; Sense: No; ComponentHeight: 0.8mm; Author: CERN DEM MR; HelpURL: \\cern.ch\dfs\Applications\Altium\Datasheets\ADCLK948BCPZ.pdf; CreateDate: 2016-11-30; LatestRevisionDate: 2016-11-30
L1 = IND_3.3UH_30%_WURTH_WE-TPC_744043003: Inductor With Core; Part Description: Shielded Tiny Power Inductor (WE-TPC Serie); Manufacturer: WURTH ELEKTRONIK; Power: 2.15A; Resistance: 0.03R; Tolerance: ±30%; Part Number: IND_3.3UH_30%_WURTH_WE-TPC_744043003; Component Kind: Standard; Component Type: Standard; Pin Count: 2; Value: 3.3uH; Manufacturer Part Number: 744043003; Mounted: Yes; Socket: No; SMD: Yes; Sense: No; ComponentHeight: 3mm; HelpURL: \\cern.ch\dfs\Applications\Altium\Datasheets\IND_WURTH_WE-TPC_744043003.pdf; Author: CERN DEM JLC; CreateDate: 12.07.2011; LatestRevisionDate: 24.01.2012
L29 L36-L38 = IND0603_MURATA_BLM18SG121TN1D: Inductor; Part Description: SMD EMIFIL Suppression Chip Ferrite Bead; Manufacturer: MURATA; Power: 3A; Resistance: 0.025R; Tolerance: ±25%; Part Number: IND0603_MURATA_BLM18SG121TN1D; Component Kind: Standard; Component Type: Standard; Pin Count: 2; Value: 120R@100MHz; Status: None; Manufacturer Part Number: BLM18SG121TN1D; Case: 0603; Mounted: Yes; Socket: No; SMD: Yes; Sense: No; ComponentHeight: 0.65mm; HelpURL: \\cern.ch\dfs\Applications\Altium\Datasheets\IND0603_MURATA_BLM18S.pdf; Author: CERN DEM JLC; CreateDate: 23.07.2014; LatestRevisionDate: 23.07.2014
L32 L34 L35 = IND_2.2UH_20%_WURTH_WE-PMCI_74479276222C: Inductor; Part Description: SMD Power Molded Chip  Inductor (WE-PMCI Series); Manufacturer: WURTH ELEKTRONIK; Power: 1.1A; Resistance: 0.112R; Tolerance: ±20%; Part Number: IND_2.2UH_20%_WURTH_WE-PMCI_74479276222C; Component Kind: Standard; Component Type: Standard; Pin Count: 2; Value: 2.2uH; Status: None; Manufacturer Part Number: 74479276222C; Case: 0806; Mounted: Yes; Socket: No; SMD: Yes; Sense: No; ComponentHeight: 1mm; HelpURL: \\cern.ch\dfs\Applications\Altium\Datasheets\IND_WURTH_WE-PMCI_74479276222C.pdf; Author: CERN DEM JLC; CreateDate: 20.10.2016; LatestRevisionDate: 20.10.2016
LD1 = LED_KINGBRIGHT_KPH-1608CGCK: LED Green 1C 2A; Part Description: SMD Green LED, Case 1.6mmX0.8mm(0603), 0.65mm Thickness; PressFit: No; Bonding: No; Manufacturer Part Number: KPH-1608CGCK; ComponentHeight: 0.65mm; HelpURL: \\cern.ch\dfs\Applications\Altium\Datasheets\LED_KINGBRIGHT_KPH-1608CGCK.pdf; Part Number: LED_KINGBRIGHT_KPH-1608CGCK; Component Kind: Standard; Component Type: Standard; Color: Green; PackageDescription: SMT Green LED, Case 0603, Body L 1.6 x W 0.8mm H 0.65mm; Manufacturer: KINGBRIGHT; Pin Count: 2; Mounted: Yes; Socket: No; SMD: Yes; Sense: No; Author: CERN DEM JLC; CreateDate: 03.07.2017; LatestRevisionDate: 03.07.2017
OSC1 OSC3 = OSC_0.2-250MHZ_SILICON-LAB_549CBAC000112ABG: Any-Rate I2C Programmable XO Oscillator Si549 Series; Manufacturer: SILICON LABS; Part Description: 0.2-250MHz, 1.8V/2.5V/3.3V ±10ppm CMOS , Any-Rate I2C Programmable XO Oscillator Si549 Series; PressFit: No; Bonding: No; Part Number: OSC_0.2-250MHZ_SILICON-LAB_549CBAC000112ABG; Value: 0.2-250MHz; Component Kind: Standard; Component Type: Standard; PackageDescription: Oscillator Si549 Series, 8 pins, 5x7mm; Pin Count: 8; Mounted: Yes; Socket: No; SMD: Yes; Sense: No; ComponentHeight: 1.33mm; HelpURL: \\cern.ch\dfs\Applications\Altium\Datasheets\OSC_SILICON-LAB_SI549.pdf; Author: CERN DEM BC; CreateDate: 25.10.2019; LatestRevisionDate: 25.10.2019
Q3 = XTAL_114.285MHZ_CONNOR_CS-023: Crystal 4 pins 1=XTAL Control 2=GND3=XTAL 4=GND; Part Description: ±20ppm 18pF -40°C to +85°C  4 Pins, 3.2x2.5X0.8mm, SMD Crystal Unit, CS-018 Series; Manufacturer: CONNOR-WINFIELD; Manufacturer Part Number: CS-023-114.285M; PressFit: No; Bonding: No; Part Number: XTAL_114.285MHZ_CONNOR_CS-023; Component Kind: Standard; Component Type: Standard; PackageDescription: 4 Pins, 2.5x3.2mm, SMD Sealing Crystal, CS Series; Value: 114.285MHZ; Pin Count: 4; Mounted: Yes; Socket: No; SMD: Yes; Sense: No; ComponentHeight: 0.8mm; HelpURL: \\cern.ch\dfs\Applications\Altium\Datasheets\XTAL_CONNOR_CS-023.pdf; Author: CERN DEM JLC; CreateDate: 2014-07-08; LatestRevisionDate: 2014-07-08
R4 R6-R8 R16 R21 R22 R24 R29-R31 R39 R40 R47 R48 R80 R82 R85 R87 = R0402_200R_1%_0.0625W_100PPM: Resistor - 1%; Part Description: General Purpose Thick Film Chip Resistor; Manufacturer: GENERIC; Manufacturer1 Part Number: 232270672001L; TC: ±100ppm/°C; PressFit: No; Part Number: R0402_200R_1%_0.0625W_100PPM; Component Kind: Standard; Component Type: Standard; Pin Count: 2; Value: 200; Status: Not Recommended; Power: 0.0625W; Tolerance: ±1%; Manufacturer Part Number: R0402_200R_1%_0.0625W_100PPM; Case: 0402; Mounted: Yes; Sense: No; Socket: No; SMD: Yes; Manufacturer1 Example: YAGEO PHYCOMP; Manufacturer1 ComponentHeight: 0.4mm; HelpURL: \\cern.ch\dfs\Applications\Altium\Datasheets\R0402_Phycomp_RC0402.pdf; Author: CERN DEM JLC; CreateDate: 03.12.2007; LatestRevisionDate: 17.10.2012
R5 = R0402_56K_1%_0.0625W_100PPM: Resistor - 1%; Part Description: General Purpose Thick Film Chip Resistor; Manufacturer: GENERIC; Manufacturer1 Part Number: 232270675603L; TC: ±100ppm/°C; PressFit: No; Part Number: R0402_56K_1%_0.0625W_100PPM; Component Kind: Standard; Component Type: Standard; Pin Count: 2; Value: 56k; Status: Not Recommended; Power: 0.0625W; Manufacturer Part Number: R0402_56K_1%_0.0625W_100PPM; Case: 0402; Mounted: Yes; Sense: No; Socket: No; SMD: Yes; Manufacturer1 Example: YAGEO PHYCOMP; Manufacturer1 ComponentHeight: 0.4mm; HelpURL: \\cern.ch\dfs\Applications\Altium\Datasheets\R0402_Phycomp_RC0402.pdf; Author: CERN DEM JLC; CreateDate: 03.12.2007; LatestRevisionDate: 17.10.2012
R10 R25 R71 = R0402_33K_1%_0.0625W_100PPM: Resistor - 1%; Part Description: General Purpose Thick Film Chip Resistor; Manufacturer: GENERIC; Manufacturer1 Part Number: 232270673303L; TC: ±100ppm/°C; PressFit: No; Part Number: R0402_33K_1%_0.0625W_100PPM; Component Kind: Standard; Component Type: Standard; Pin Count: 2; Value: 33k; Status: Not Recommended; Power: 0.0625W; Tolerance: ±1%; Manufacturer Part Number: R0402_33K_1%_0.0625W_100PPM; Case: 0402; Mounted: Yes; Sense: No; Socket: No; SMD: Yes; Manufacturer1 Example: YAGEO PHYCOMP; Manufacturer1 ComponentHeight: 0.4mm; HelpURL: \\cern.ch\dfs\Applications\Altium\Datasheets\R0402_Phycomp_RC0402.pdf; Author: CERN DEM JLC; CreateDate: 12/3/2007; LatestRevisionDate: 10/17/2012
R12 = R0402_16K_1%_0.0625W_100PPM: Resistor - 1%; Part Description: General Purpose Thick Film Chip Resistor; Manufacturer: GENERIC; Manufacturer1 Part Number: 232270671603L; TC: ±100ppm/°C; PressFit: No; Part Number: R0402_16K_1%_0.0625W_100PPM; Component Kind: Standard; Component Type: Standard; Pin Count: 2; Value: 16k; Status: Not Recommended; Power: 0.0625W; Manufacturer Part Number: R0402_16K_1%_0.0625W_100PPM; Case: 0402; Mounted: Yes; Sense: No; Socket: No; SMD: Yes; Manufacturer1 Example: YAGEO PHYCOMP; Manufacturer1 ComponentHeight: 0.4mm; HelpURL: \\cern.ch\dfs\Applications\Altium\Datasheets\R0402_Phycomp_RC0402.pdf; Author: CERN DEM JLC; CreateDate: 03.12.2007; LatestRevisionDate: 17.10.2012
R27 R36 R38 R54 R56 R68 R83 R84 R86 R97 R98 = R0402_0R_JUMPER: Resistor; Part Description: 1A (0.05R Max DC Resistance) Zero Ohm Jumper; Manufacturer: GENERIC; Manufacturer1 Part Number: 232270591001L; PressFit: No; Part Number: R0402_0R_JUMPER; Component Kind: Standard; Component Type: Standard; Pin Count: 2; Value: 0; Status: Not Recommended; Manufacturer Part Number: R0402_0R_JUMPER; Case: 0402; Mounted: Yes; Sense: No; Socket: No; SMD: Yes; Manufacturer1 Example: YAGEO PHYCOMP; Manufacturer1 ComponentHeight: 0.4mm; HelpURL: \\cern.ch\dfs\Applications\Altium\Datasheets\R0402_Phycomp_RC0402.pdf; Author: CERN DEM JLC; CreateDate: 03.12.2007; LatestRevisionDate: 17.10.2012
R34 R35 R41 R50 = R0402_2K2_1%_0.0625W_100PPM: Resistor - 1%; Part Description: General Purpose Thick Film Chip Resistor; Manufacturer: GENERIC; Manufacturer1 Part Number: 232270672202L; TC: ±100ppm/°C; PressFit: No; Part Number: R0402_2K2_1%_0.0625W_100PPM; Component Kind: Standard; Component Type: Standard; Pin Count: 2; Value: 2k2; Status: Not Recommended; Power: 0.0625W; Tolerance: ±1%; Manufacturer Part Number: R0402_2K2_1%_0.0625W_100PPM; Case: 0402; Mounted: Yes; Sense: No; Socket: No; SMD: Yes; Manufacturer1 Example: YAGEO PHYCOMP; Manufacturer1 ComponentHeight: 0.4mm; HelpURL: \\cern.ch\dfs\Applications\Altium\Datasheets\R0402_Phycomp_RC0402.pdf; Author: CERN DEM JLC; CreateDate: 03.12.2007; LatestRevisionDate: 17.10.2012
R37 R225 = R0402_30R_1%_0.0625W_100PPM: Resistor - 1%; Part Description: General Purpose Thick Film Chip Resistor; Manufacturer: GENERIC; Manufacturer1 Part Number: 232270673009L; TC: ±100ppm/°C; PressFit: No; Part Number: R0402_30R_1%_0.0625W_100PPM; Component Kind: Standard; Component Type: Standard; Pin Count: 2; Value: 30; Status: Not Recommended; Power: 0.0625W; Tolerance: ±1%; Manufacturer Part Number: R0402_30R_1%_0.0625W_100PPM; Case: 0402; Mounted: Yes; Socket: No; SMD: Yes; Manufacturer1 Example: YAGEO PHYCOMP; Manufacturer1 ComponentHeight: 0.4mm; HelpURL: \\cern.ch\dfs\Applications\Altium\Datasheets\R0402_Phycomp_RC0402.pdf; Author: CERN DEM JLC; CreateDate: 03.12.2007; LatestRevisionDate: 17.10.2012; Sense: No
R59 = R0402_430K_1%_0.0625W_100PPM: Resistor - 1%; Manufacturer: GENERIC; Part Description: General Purpose Thick Film Chip Resistor; Manufacturer1 Part Number: 232270674304L; TC: ±100ppm/°C; PressFit: No; Manufacturer Part Number: R0402_430K_1%_0.0625W_100PPM; Part Number: R0402_430K_1%_0.0625W_100PPM; Tolerance: ±1%; Value: 430k; Component Kind: Standard; Component Type: Standard; Pin Count: 2; Status: Not Recommended; Power: 0.0625W; Case: 0402; Mounted: Yes; Sense: No; Socket: No; SMD: Yes; Manufacturer1 Example: YAGEO PHYCOMP; Manufacturer1 ComponentHeight: 0.4mm; HelpURL: \\cern.ch\dfs\Applications\Altium\Datasheets\R0402_Phycomp_RC0402.pdf; Author: CERN DEM JLC; CreateDate: 03.12.2007; LatestRevisionDate: 17.10.2012
R61 R70 = R0402_82K_1%_0.0625W_100PPM: Resistor - 1%; Manufacturer: GENERIC; Part Description: General Purpose Thick Film Chip Resistor; Manufacturer1 Part Number: 232270678203L; TC: ±100ppm/°C; PressFit: No; Manufacturer Part Number: R0402_82K_1%_0.0625W_100PPM; Part Number: R0402_82K_1%_0.0625W_100PPM; Tolerance: ±1%; Value: 82k; Component Kind: Standard; Component Type: Standard; Pin Count: 2; Status: Not Recommended; Power: 0.0625W; Case: 0402; Mounted: Yes; Sense: No; Socket: No; SMD: Yes; Manufacturer1 Example: YAGEO PHYCOMP; Manufacturer1 ComponentHeight: 0.4mm; HelpURL: \\cern.ch\dfs\Applications\Altium\Datasheets\R0402_Phycomp_RC0402.pdf; Author: CERN DEM JLC; CreateDate: 03.12.2007; LatestRevisionDate: 17.10.2012
R66 = R0402_82K_1%_0.0625W_100PPM: Resistor - 1%; Part Description: General Purpose Thick Film Chip Resistor; Manufacturer: GENERIC; Manufacturer1 Part Number: 232270678203L; TC: ±100ppm/°C; PressFit: No; Part Number: R0402_82K_1%_0.0625W_100PPM; Component Kind: Standard; Component Type: Standard; Pin Count: 2; Value: 82k; Status: Not Recommended; Power: 0.0625W; Tolerance: ±1%; Manufacturer Part Number: R0402_82K_1%_0.0625W_100PPM; Case: 0402; Mounted: Yes; Sense: No; Socket: No; SMD: Yes; Manufacturer1 Example: YAGEO PHYCOMP; Manufacturer1 ComponentHeight: 0.4mm; HelpURL: \\cern.ch\dfs\Applications\Altium\Datasheets\R0402_Phycomp_RC0402.pdf; Author: CERN DEM JLC; CreateDate: 03.12.2007; LatestRevisionDate: 17.10.2012
R67 R72-R78 R88-R91 = R0402_10K_1%_0.0625W_100PPM: Resistor - 1%; Part Description: General Purpose Thick Film Chip Resistor; Manufacturer: GENERIC; Manufacturer1 Part Number: 232270671003L; TC: ±100ppm/°C; PressFit: No; Part Number: R0402_10K_1%_0.0625W_100PPM; Component Kind: Standard; Component Type: Standard; Pin Count: 2; Value: 10k; Status: Not Recommended; Power: 0.0625W; Tolerance: ±1%; Manufacturer Part Number: R0402_10K_1%_0.0625W_100PPM; Case: 0402; Mounted: Yes; Sense: No; Socket: No; SMD: Yes; Manufacturer1 Example: YAGEO PHYCOMP; Manufacturer1 ComponentHeight: 0.4mm; HelpURL: \\cern.ch\dfs\Applications\Altium\Datasheets\R0402_Phycomp_RC0402.pdf; Author: CERN DEM JLC; CreateDate: 03.12.2007; LatestRevisionDate: 17.10.2012
R69 = R0402_100R_1%_0.0625W_100PPM: Resistor - 1%; Part Description: General Purpose Thick Film Chip Resistor; Manufacturer: GENERIC; Manufacturer1 Part Number: 232270671001L; TC: ±100ppm/°C; PressFit: No; Part Number: R0402_100R_1%_0.0625W_100PPM; Component Kind: Standard; Component Type: Standard; Pin Count: 2; Value: 100; Status: Not Recommended; Power: 0.0625W; Tolerance: ±1%; Manufacturer Part Number: R0402_100R_1%_0.0625W_100PPM; Case: 0402; Mounted: Yes; Sense: No; Socket: No; SMD: Yes; Manufacturer1 Example: YAGEO PHYCOMP; Manufacturer1 ComponentHeight: 0.4mm; HelpURL: \\cern.ch\dfs\Applications\Altium\Datasheets\R0402_Phycomp_RC0402.pdf; Author: CERN DEM JLC; CreateDate: 03.12.2007; LatestRevisionDate: 17.10.2012
R79 = R0402_1k_1%_0.0625W_100PPM: Resistor - 1%; Part Description: General Purpose Thick Film Chip Resistor; Manufacturer: GENERIC; Manufacturer1 Part Number: 232270671002L; TC: ±100ppm/°C; PressFit: No; Part Number: R0402_1K_1%_0.0625W_100PPM; Component Kind: Standard; Component Type: Standard; Pin Count: 2; Value: 1k; Status: Not Recommended; Power: 0.0625W; Tolerance: ±1%; Manufacturer Part Number: R0402_1K_1%_0.0625W_100PPM; Case: 0402; Mounted: Yes; Sense: No; Socket: No; SMD: Yes; Manufacturer1 Example: YAGEO PHYCOMP; Manufacturer1 ComponentHeight: 0.4mm; HelpURL: \\cern.ch\dfs\Applications\Altium\Datasheets\R0402_Phycomp_RC0402.pdf; Author: CERN DEM JLC; CreateDate: 03.12.2007; LatestRevisionDate: 17.10.2012
R81 = R0402_4K7_1%_0.0625W_100PPM: Resistor - 1%; Part Description: General Purpose Thick Film Chip Resistor; Manufacturer: GENERIC; Manufacturer1 Part Number: 232270674702L; TC: ±100ppm/°C; PressFit: No; Part Number: R0402_4K7_1%_0.0625W_100PPM; Component Kind: Standard; Component Type: Standard; Pin Count: 2; Value: 4k7; Status: Not Recommended; Power: 0.0625W; Tolerance: ±1%; Manufacturer Part Number: R0402_4K7_1%_0.0625W_100PPM; Case: 0402; Mounted: Yes; Sense: No; Socket: No; SMD: Yes; Manufacturer1 Example: YAGEO PHYCOMP; Manufacturer1 ComponentHeight: 0.4mm; HelpURL: \\cern.ch\dfs\Applications\Altium\Datasheets\R0402_Phycomp_RC0402.pdf; Author: CERN DEM JLC; CreateDate: 03.12.2007; LatestRevisionDate: 17.10.2012
T2 = BSH103: N-CHANNEL MOSFET WITH DIODE; Part Description: 30V 850mA N-Channel Enhancement Mode Field-Effect Transistor; Manufacturer: NEXPERIA; PressFit: No; Bonding: No; Part Number: BSH103; Component Kind: Standard; Component Type: Standard; Device: BSH103; PackageDescription: SOT23, 3 pin, Pitch 0.95mm - 1.3mm W X 2.9mm L X 1.1mm H, IPC Medium Density; Manufacturer Part Number: BSH103; Pin Count: 3; Case: SOT23-3; Mounted: Yes; Socket: No; SMD: Yes; Sense: No; ComponentHeight: 1.1mm; HelpURL: \\cern.ch\dfs\Applications\Altium\Datasheets\BSH103.pdf; Author: CERN DEM JLC; CreateDate: 16.03.2010; LatestRevisionDate: 20.06.2017
TP23-TP27 TP29 TP30 = SMD_PAD_1.27X1.27MM: Part Description: 1.27mm x 1.27mm PCB Copper Area (SMD Test Point); Mounted: No; Part Number: SMD_PAD_1.27X1.27MM; Component Type: Standard (No BOM); Pin Count: 1; Family: Test Point; Socket: No; SMD: Yes; Sense: No; Status: None; ComponentHeight: 0mm; HelpURL: Undefined; Author: CERN DEM JLC; CreateDate: 12.01.2008; LatestRevisionDate: 12.01.2008; PackageDescription: 1.27mm x 1.27mm PCB Copper Area (SMD Test Point)
TP28 = SMD_PAD_1.27X1.27MM: Test Point; Part Description: 1.27mm x 1.27mm PCB Copper Area (SMD Test Point); Mounted: No; Part Number: SMD_PAD_1.27X1.27MM; Component Type: Standard (No BOM); Pin Count: 1; Family: Test Point; Socket: No; SMD: Yes; Sense: No; Status: None; ComponentHeight: 0mm; HelpURL: Undefined; Author: CERN DEM JLC; CreateDate: 12.01.2008; LatestRevisionDate: 12.01.2008; PackageDescription: 1.27mm x 1.27mm PCB Copper Area (SMD Test Point)